# EAGLE design ps2 (EAGLE 6.5.0)
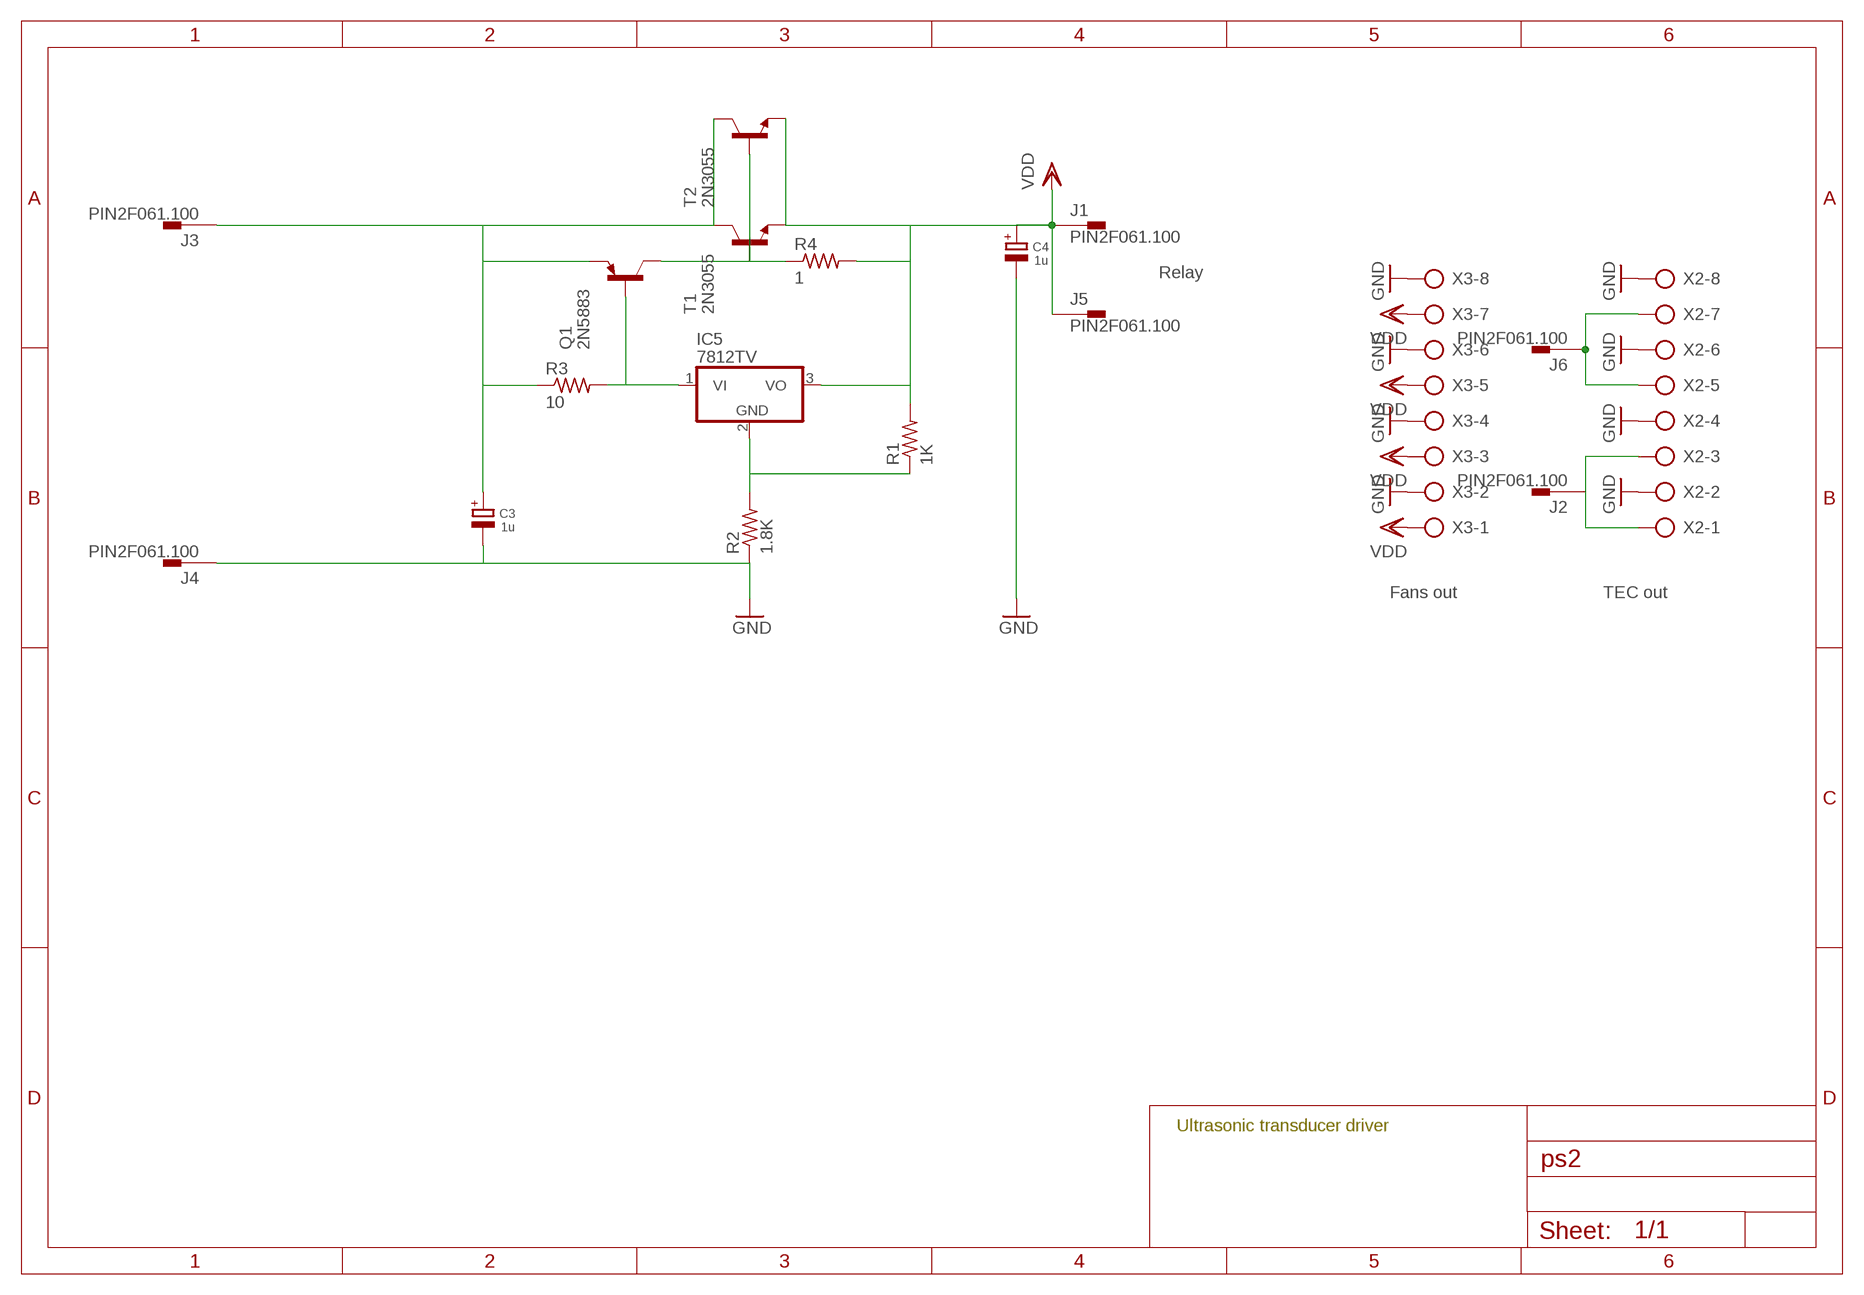
[diagram p0: schematic, sheet 1]

## Parts
C3  1u  CPOL-EUE10-20  [EB20D]
C4  1u  CPOL-EUE10-20  [EB20D]
IC5  7812TV  [TO220V]
J1  PIN2F061.100  [F061.100]
J2  PIN2F061.100  [F061.100]
J3  PIN2F061.100  [F061.100]
J4  PIN2F061.100  [F061.100]
J5  PIN2F061.100  [F061.100]
J6  PIN2F061.100  [F061.100]
Q1  2N5883  2N4905  [TO3]
R1  1K  R-US_0207/15  [0207/15]
R2  1.8K  R-US_0207/15  [0207/15]
R3  10  R-US_0207/15  [0207/15]
R4  1  R-US_0922/22  [0922/22]
T1  2N3055  [TO3]
T2  2N3055  [TO3]
X2  AK300/8  [AK300/8]
X3  AK300/8  [AK300/8]

## Nets
GND: C3.- C4.- J4.A1 J4.A2 R2.1 X2.2 X2.4 X2.6 X2.8 X3.2 X3.4 X3.6 X3.8
N$1: Q1.C Q1.C/(C) R4.1 T1.B T2.B
N$4: IC5.1(VI) Q1.B R3.2
N$5: IC5.2(GND) R1.1 R2.2
TEC1: J2.A1 J2.A2 X2.1 X2.3
TEC2: J6.A1 J6.A2 X2.5 X2.7
VDD: C4.+ IC5.3(VO) J1.A1 J1.A2 J5.A1 J5.A2 R1.2 R4.2 T1.E T2.E X3.1 X3.3 X3.5 X3.7
VIN: C3.+ J3.A1 J3.A2 Q1.E R3.1 T1.C T1.C/(C) T2.C T2.C/(C)

## Notes on the sheet
- Relay
- Fans out | TEC out
- Ultrasonic transducer driver

## Library data of the parts
C3 C4 = rcl:CPOL-EU: POLARIZED CAPACITOR, European symbol
IC5 = linear:78*: Positive VOLTAGE REGULATOR Source: http://cache.national.com/ds/LM/LM78L05.pdf http://www.fairchildsemi.com/ds/LM/LM7805.pdf
J1-J6 = con-faston:PIN2: Flachstecker Typ Tyco/Electronics/AMP TAB, FASTON Printed Circuit Board Tabs Source: http://www.buerklin.com, http://catalog.tycoelectronics.com; OC_FARNELL: unknown; OC_NEWARK: unknown
Q1 = transistor-pnp:2N4905: PNP Transistor
R1-R4 = rcl:R-US_: RESISTOR, American symbol
T1 T2 = transistor:2N3055: NPN TRANSISTOR
X2 X3 = con-ptr500:AK300/8: CONNECTOR; OC_FARNELL: unknown; OC_NEWARK: unknown

## Board
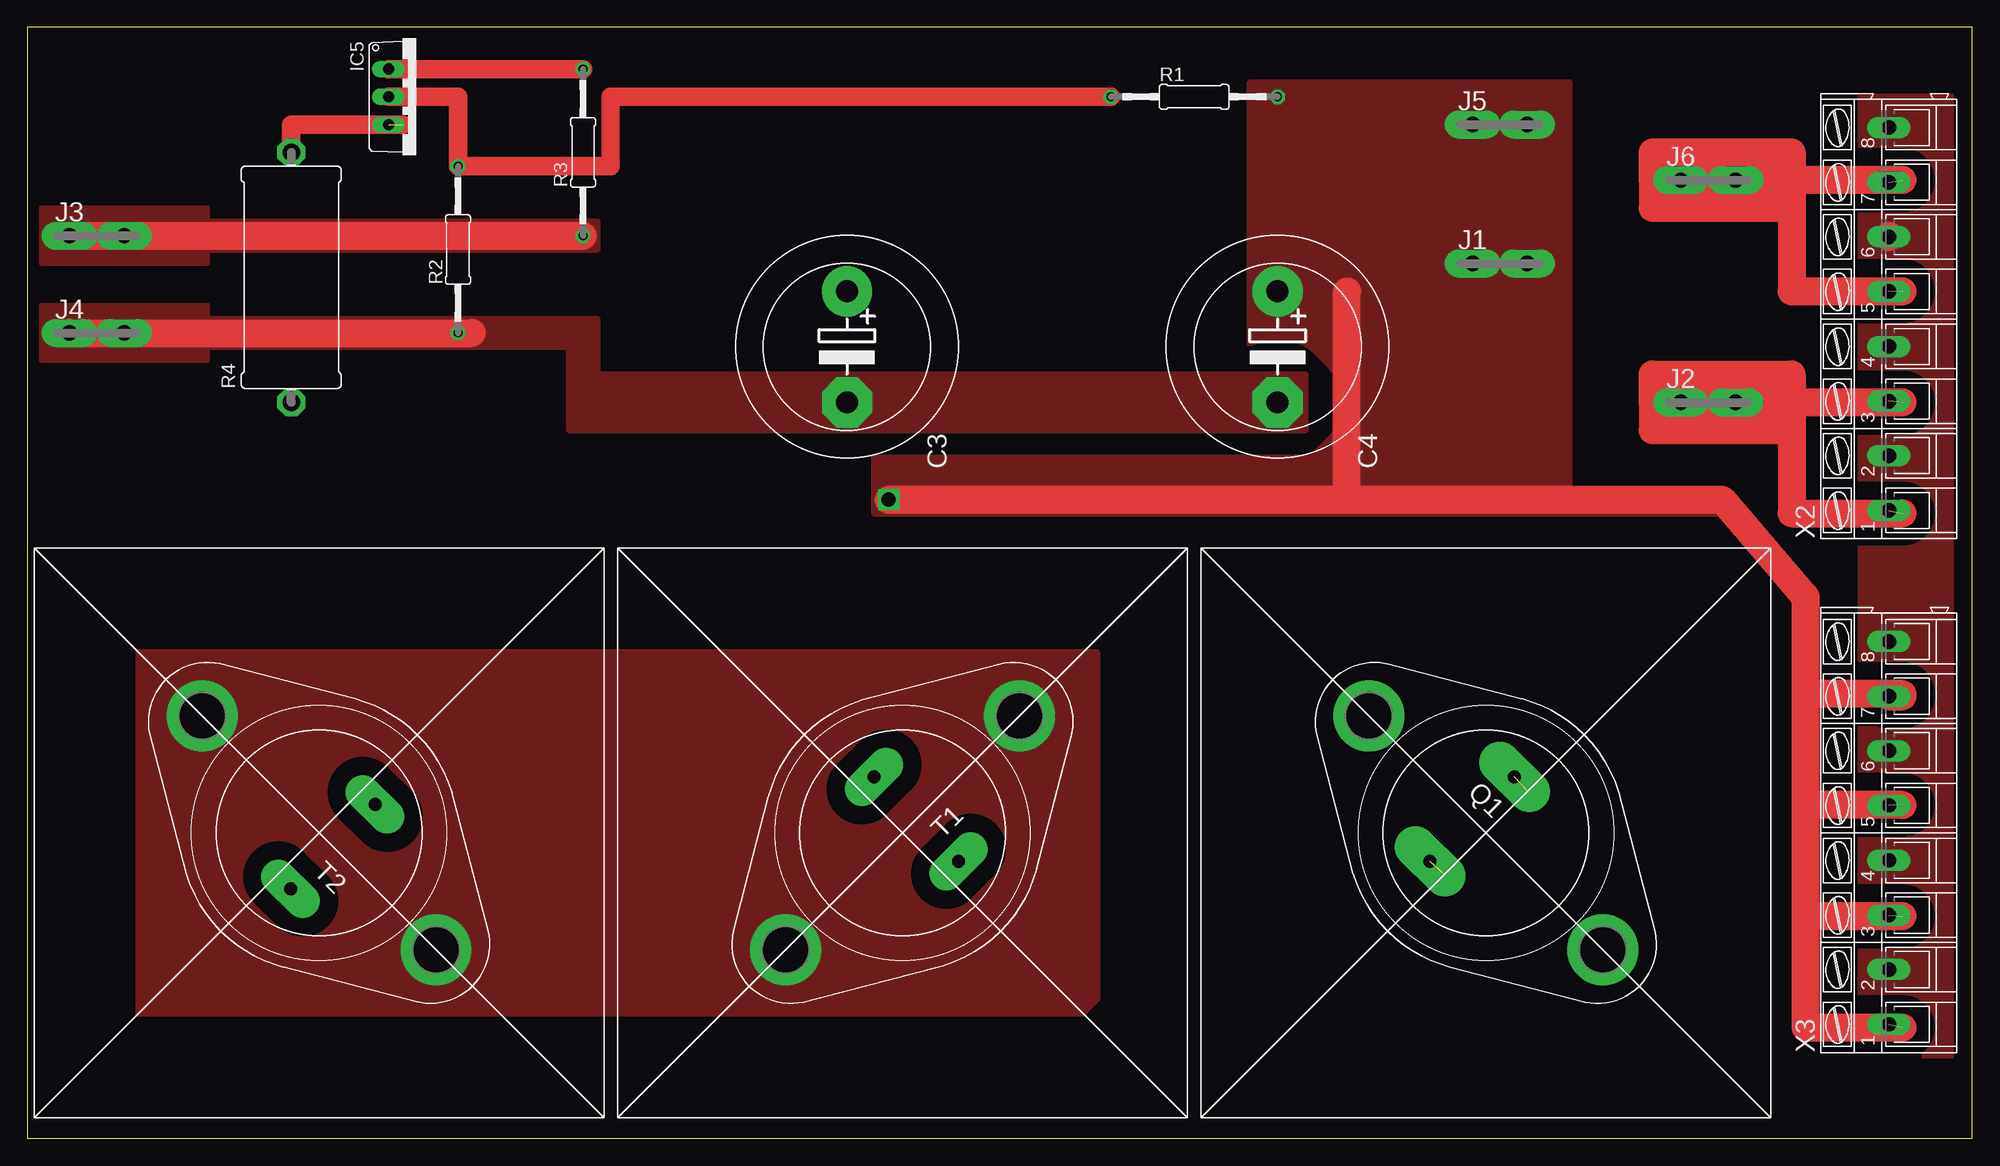
[diagram p1: board, top side]
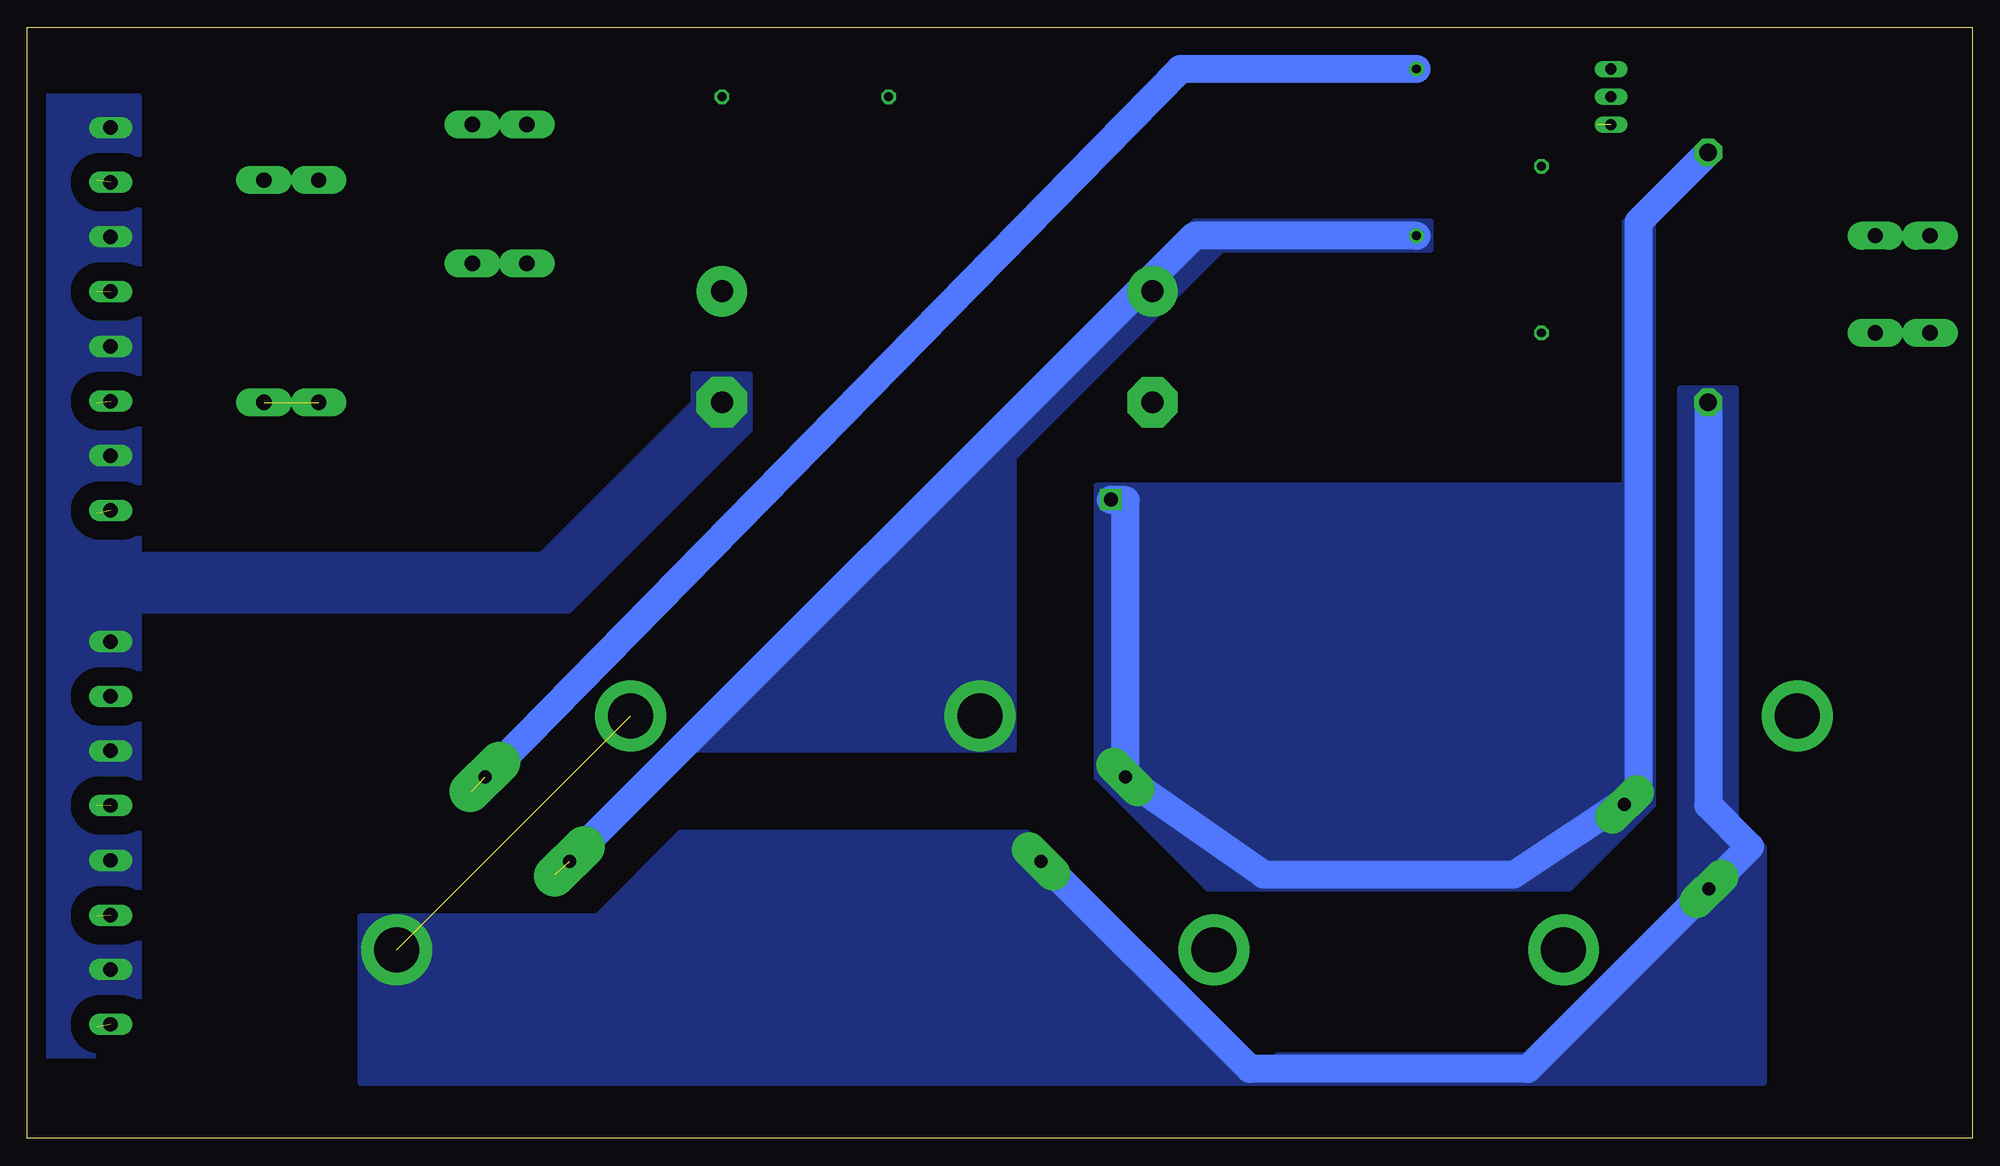
[diagram p2: board, bottom side, seen from below]

Size 177.8 x 101.6 mm. Coordinates in mm from the lower left corner, seen from the top.
Outline: 0,0 177.8,0 177.8,101.6 0,101.6 0,0
Copper layers (1*16): Top 0.035mm / dielectric 1.5mm / Bottom 0.035mm
Design rules "default": minimum track width 10mil, minimum drill 24mil, track to track 8mil, track to pad 8mil, pad to pad 8mil, via to via 8mil, smd to smd 8mil, copper to edge 40mil, drill to drill 8mil, minimum pad ring 10mil, minimum via ring 8mil, stop-mask expansion 4mil, vias tented up to drill 0mil, thermal gap 10mil

### Footprints (pad centres in the part's own frame; a part is rotated, then mirrored left to right if it is on the bottom)
EB20D = drill 2.007 pad 4.597: + -5.08,0 | drill 2.007 pad 4.597 octagon: - 5.08,0
TO220V = drill 1.016 long: 1 -2.54,-2.54; 2 0,-2.54; 3 2.54,-2.54
F061.100 = drill 1.4 pad 2.54 long: A1 -2.5,0; A2 2.5,0
TO3 = drill 1.194 pad 3.81 long: B -1.778,5.461; E -1.778,-5.461 | drill 4.115 pad 6.477: C 15.113,0; C/ -15.113,0
0207/15 = drill 0.813 octagon: 1 -7.62,0; 2 7.62,0
0922/22 = drill 1.6 pad 2.54 octagon: 1 -11.43,0; 2 11.43,0
TO3' = drill 1.194 pad 3.15 long: B -1.778,5.461; E -1.778,-5.461 | drill 4.115 pad 6.477: C 15.113,0; C/ -15.113,0
AK300/8 = drill 1.321 long: 1 -17.501,0; 2 -12.497,0; 3 -7.518,0; 4 -2.515,0; 5 2.515,0; 6 7.518,0; 7 12.497,0; 8 17.501,0

### Placement (x,y rotation side)
C3  74.93,72.39 270 top
C4  114.3,72.39 270 top
IC5  35.56,95.25 270 top
J1  134.62,80.01 0 top
J2  153.67,67.31 0 top
J3  6.35,82.55 0 top
J4  6.35,73.66 0 top
J5  134.62,92.71 0 top
J6  153.67,87.63 0 top
Q1  133.35,27.94 315 top
R1  106.68,95.25 0 top
R2  39.37,81.28 90 top
R3  50.8,90.17 90 top
R4  24.13,78.74 90 top
T1  2N3055  [TO3']  80.01,27.94 225 top
T2  2N3055  [TO3']  26.67,27.94 135 top
X2  170.18,74.93 90 top
X3  170.18,27.94 90 top

### Tracks (layer width: path | path; a pad name or v marks a point on that pad's centre or on a via)
GND
  Top 2.54: J4.A1 40.64,73.66 | 170.18,82.55 X2.6
  pour Top (isolate 1.676, no thermals): 38.1,74.93 52.07,74.93 52.07,69.85 116.84,69.85 116.84,64.77 49.53,64.77 49.53,72.39 38.1,72.39
  pour Top (isolate 1.676, no thermals): 167.64,95.25 167.64,7.62 177.8,7.62 177.8,95.25
  pour Bottom (isolate 1.676, no thermals): 111.76,69.85 111.76,64.77 128.27,48.26 167.64,48.26 167.64,7.62 176.53,7.62 176.53,95.25 167.64,95.25 167.64,53.34 130.81,53.34 116.84,67.31 116.84,69.85
  pour Top (isolate 1.676): 1.27,74.93 52.07,74.93 52.07,72.39 1.27,72.39
  pour Top (no thermals): 1.27,74.93 1.27,71.12 16.51,71.12 16.51,76.2 1.27,76.2
N$1  (1 unrouted)
  Bottom 2.54: R4.1 24.13,30.48 20.32,26.67 40.64,6.35 66.04,6.35 86.36,26.67
  pour Bottom (isolate 1.676, no thermals): 63.5,5.08 107.95,5.08 107.95,27.94 86.36,27.94
  pour Bottom (isolate 1.676, no thermals): 63.5,5.08 19.05,5.08 19.05,26.67 20.32,27.94 40.64,7.62 63.5,7.62
  pour Bottom (isolate 1.676, no thermals): 19.05,26.67 21.59,27.94 21.59,68.58 26.67,68.58 26.67,21.59 19.05,21.59
  pour Bottom (no thermals): 106.68,27.94 118.11,27.94 125.73,20.32 147.32,20.32 147.32,5.08 107.95,5.08 107.95,26.67
N$4  (1 unrouted)
  Top 1.676: IC5.1 R3.2
  Bottom 2.54: R3.2 72.39,97.79 137.16,31.75
N$5
  Top 1.676: IC5.2 39.37,95.25 R2.2 53.34,88.9 53.34,95.25 R1.1
TEC1  (3 unrouted)
  Top 2.54: 161.29,67.31 J2.A1 148.59,67.31 | 171.45,67.31 161.29,67.31 | 161.29,67.31 161.29,64.77 | 161.29,64.77 161.29,57.15 171.45,57.15 | 148.59,67.31 148.59,64.77 161.29,64.77 | 148.59,67.31 148.59,69.85 161.29,69.85 161.29,67.31
TEC2  (2 unrouted)
  Top 2.54: 161.29,87.63 J6.A2 J6.A1 148.59,87.63 | 171.45,87.63 161.29,87.63 | 161.29,87.63 161.29,85.09 | 161.29,85.09 161.29,77.47 171.45,77.47 | 148.59,87.63 148.59,85.09 161.29,85.09 | 148.59,87.63 148.59,90.17 161.29,90.17 161.29,88.9
VDD  (via drill 1.3)  (4 unrouted)
  Top 1.676: R4.2 24.13,92.71 34.29,92.71
  Top 2.54: v78.74,58.42 120.65,58.42 | 120.65,58.42 120.65,77.47 | X3.7 171.45,40.44 171.45,40.64 162.56,40.64 | 162.56,40.64 162.56,30.48 | 171.45,30.48 162.56,30.48 | 162.56,30.48 162.56,20.32 | 171.45,20.32 162.56,20.32 | 162.56,20.32 162.56,10.16 171.45,10.16 | 120.65,58.42 154.94,58.42 162.56,49.53 162.56,40.64
  Bottom 2.54: R4.2 30.48,83.82 30.48,31.75 41.91,24.13 64.77,24.13 77.41,32.96 T1.E 77.41,58.36 v78.74,58.42
  pour Top (isolate 3.175, no thermals): 111.76,96.52 111.76,58.42 140.97,58.42 140.97,96.52
  pour Bottom (isolate 1.676, no thermals): 29.21,59.69 80.01,59.69 80.01,33.02 69.85,22.86 36.83,22.86 29.21,30.48
  pour Bottom (isolate 1.676, no thermals): 29.21,59.69 29.21,83.82 31.75,83.82 31.75,59.69
  pour Top (isolate 1.676): 77.47,57.15 140.97,57.15 140.97,58.42 139.7,62.23 77.47,62.23
  pour Top (isolate 1.676): 140.97,57.15 154.94,57.15 154.94,58.42 139.7,58.42 139.7,57.15
VIN  (1 unrouted)
  Top 2.54: J3.A1 R3.1
  Bottom 2.54: R3.1 71.12,82.55 129.54,24.13
  pour Top (isolate 1.676, no thermals): 10.16,44.45 97.79,44.45 97.79,12.7 96.52,11.43 10.16,11.43
  pour Bottom (isolate 1.676, no thermals): 49.53,83.82 49.53,81.28 68.58,81.28 87.63,62.23 87.63,35.56 119.38,35.56 71.12,83.82
  pour Top (isolate 1.676): 1.27,83.82 52.07,83.82 52.07,81.28 1.27,81.28
  pour Top (no thermals): 1.27,83.82 1.27,80.01 16.51,80.01 16.51,85.09 1.27,85.09